# Altium project push function.PrjPcb
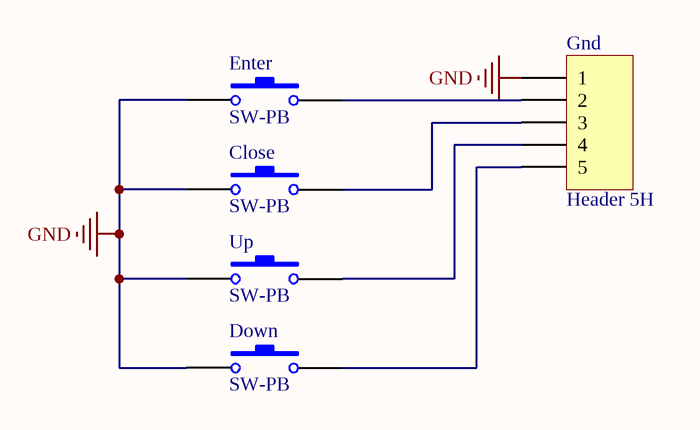
[diagram p0: Push function.SchDoc]
1 sheet, 5 parts. Net scope: global (net labels, ports and power ports of the same name join across sheets).
Board file: Push function.PcbDoc

## Sheet Push function.SchDoc
size A4

### Parts
Close  SW-PB  [SPST-2]
Down  SW-PB  [SPST-2]
Enter  SW-PB  [SPST-2]
Gnd  Header 5H  [HDR1X5H]
Up  SW-PB  [SPST-2]

### Nets
GND: Close.1 Down.1 Enter.1 Gnd.1 Up.1
NetClose_2: Close.2 Gnd.3
NetDown_2: Down.2 Gnd.5
NetEnter_2: Enter.2 Gnd.2
NetGnd_4: Gnd.4 Up.2

### Library data of the parts
Close Down Enter Up = SW-PB: Switch; Published: 24-Mar-1999; LatestRevisionDate: 17-Jul-2002; LatestRevisionNote: Re-released for DXP Platform.; PackageReference: SPST-2; Publisher: Altium Limited
Gnd = Header 5H: Header, 5-Pin, Right Angle; LatestRevisionDate: 17-Jul-2002; LatestRevisionNote: Re-released for DXP Platform.; Publisher: Altium Limited